# EAGLE design primobot (EAGLE 7.2.0)
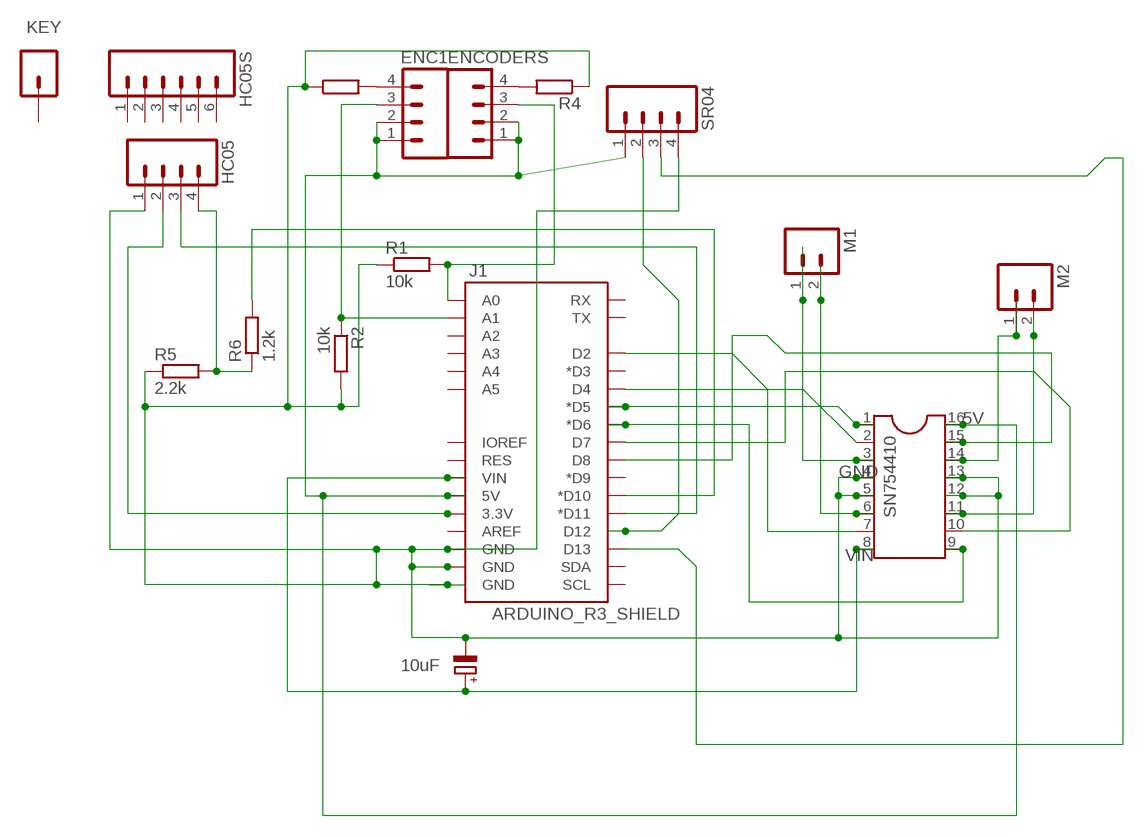
[diagram p0: schematic, sheet 1]

## Parts
C1  10uF  CPOL-EUE5-10.5  [E5-10,5]
ENC1  M04PTH  [1X04]
ENCODERS  M04PTH  [1X04]
HC05  M04PTH  [1X04]
HC05S  M06SILK_FEMALE_PTH  [1X06]
J1  ARDUINO_R3_SHIELD  [UNO_R3_SHIELD]
KEY  M01PTH  [1X01]
M1  M02PTH  [1X02]
M2  M02PTH  [1X02]
R1  10k  R-EU_0207/10  [0207/10]
R2  10k  R-EU_0207/10  [0207/10]
R3  R-EU_0207/10  [0207/10]
R4  R-EU_0207/10  [0207/10]
R5  2.2k  R-EU_0207/10  [0207/10]
R6  1.2k  R-EU_0207/10  [0207/10]
SN754410  DIL16S  [SOCKET-16]
SR04  M04PTH  [1X04]

## Nets
5V: ENC1.1 ENC1.2 ENCODERS.1 ENCODERS.2 J1.5V SN754410.16 SR04.1
GND: C1.- HC05.1 J1.GND@0(GND) J1.GND@1(GND) J1.GND@2(GND) R1.1 R2.2 R3.1 R4.1 R5.1 SN754410.4 SN754410.5 SN754410.12 SN754410.13 SR04.4
N$1: J1.D5(*D5) SN754410.1
N$2: M1.2 SN754410.6
N$3: M1.1 SN754410.3
N$4: J1.D13 SR04.3
N$5: M2.1 SN754410.14
N$6: M2.2 SN754410.11
N$7: J1.D7 SN754410.10
N$8: HC05.2 J1.3.3V
N$9: J1.D2 SN754410.7
N$10: J1.D8 SN754410.15
N$11: HC05.3 J1.D11(*D11)
N$12: J1.D6(*D6) SN754410.9
N$13: HC05.4 R5.2 R6.1
N$14: J1.D10(*D10) R6.2
N$15: ENCODERS.4 R4.2
N$16: ENC1.4 R3.2
N$17: ENCODERS.3 J1.A0 R1.2
N$18: ENC1.3 J1.A1 R2.1
N$19: J1.D4 SN754410.2
N$20: J1.D12 SR04.2
VIN: C1.+ J1.VIN SN754410.8
Unconnected: HC05S.1 HC05S.2 HC05S.3 HC05S.4 HC05S.5 HC05S.6 J1.A2 J1.A3 J1.A4 J1.A5 J1.AREF J1.D3(*D3) J1.D9(*D9) J1.IOREF J1.RES J1.RX J1.SCL J1.SDA J1.TX KEY.1

## Library data of the parts
C1 = rcl:CPOL-EU: POLARIZED CAPACITOR, European symbol
ENC1 ENCODERS HC05 SR04 = SparkFun-Connectors:M04: Header 4 Standard 4-pin 0.1" header. Use with straight break away headers (SKU : PRT-00116), right angle break away headers (PRT-00553), swiss pins (PRT-00743), machine pins (PRT-00117), and female headers (PRT-00115). Molex polarized connector foot print use with SKU : PRT-08231 with associated crimp pins and housings. 1MM SMD Version SKU: PRT-10208
HC05S = SparkFun-Connectors:M06: Header 6 Standard 6-pin 0.1" header. Use with straight break away headers (SKU : PRT-00116), right angle break away headers (PRT-00553), swiss pins (PRT-00743), machine pins (PRT-00117), and female headers (PRT-00115). Molex polarized connector foot print use with SKU : PRT-08094 with associated crimp pins and housings. NOTES ON THE VARIANTS LOCK and LOCK_LONGPADS... This footprint was designed to help hold the alignment of a through-hole component (i.e. 6-pin header) while soldering it into place. You may notice that each hole has been shifted either up or down by 0.005 of an inch from it's more standard position (which is a perfectly straight line). This slight alteration caused the pins (the squares in the middle) to touch the edges of the holes. Because they are alternating, it causes a "brace" to hold the component in place. 0.005 has proven to be the perfect amount of "off-center" position when using our standard breakaway headers. Although looks a little odd when you look at the bare footprint, once you have a header in there, the alteration is very hard to notice. Also,if you push a header all the way into place, it is covered up entirely on the bottom side. This idea of altering the position of holes to aid alignment will be further integrated into the Sparkfun Library for other footprints. It can help hold any component with 3 or more connection pins.; PROD_ID: CONN-08437
J1 = SparkFun-Boards:ARDUINO_R3_SHIELD: Shield form compatible with the Arduino Uno R3.
KEY = SparkFun-Connectors:M01: Header 1 Standard 1-pin 0.1" header. Use with straight break away headers (SKU : PRT-00116), right angle break away headers (PRT-00553), swiss pins (PRT-00743), machine pins (PRT-00117), and female headers (PRT-00115).
M1 M2 = SparkFun-Connectors:M02: Standard 2-pin 0.1" header. Use with - straight break away headers ( PRT-00116) - right angle break away headers (PRT-00553) - swiss pins (PRT-00743) - machine pins (PRT-00117) - female headers (PRT-00115) Molex polarized connector foot print use with: PRT-08233 with associated crimp pins and housings. 2.54_SCREWTERM for use with PRT-10571. 3.5mm Screw Terminal footprints for PRT-08084 5mm Screw Terminal footprints for use with PRT-08432
R1-R6 = rcl:R-EU_: RESISTOR, European symbol
SN754410 = ic-package:DIL16: Dual In Line / Socket

## Board
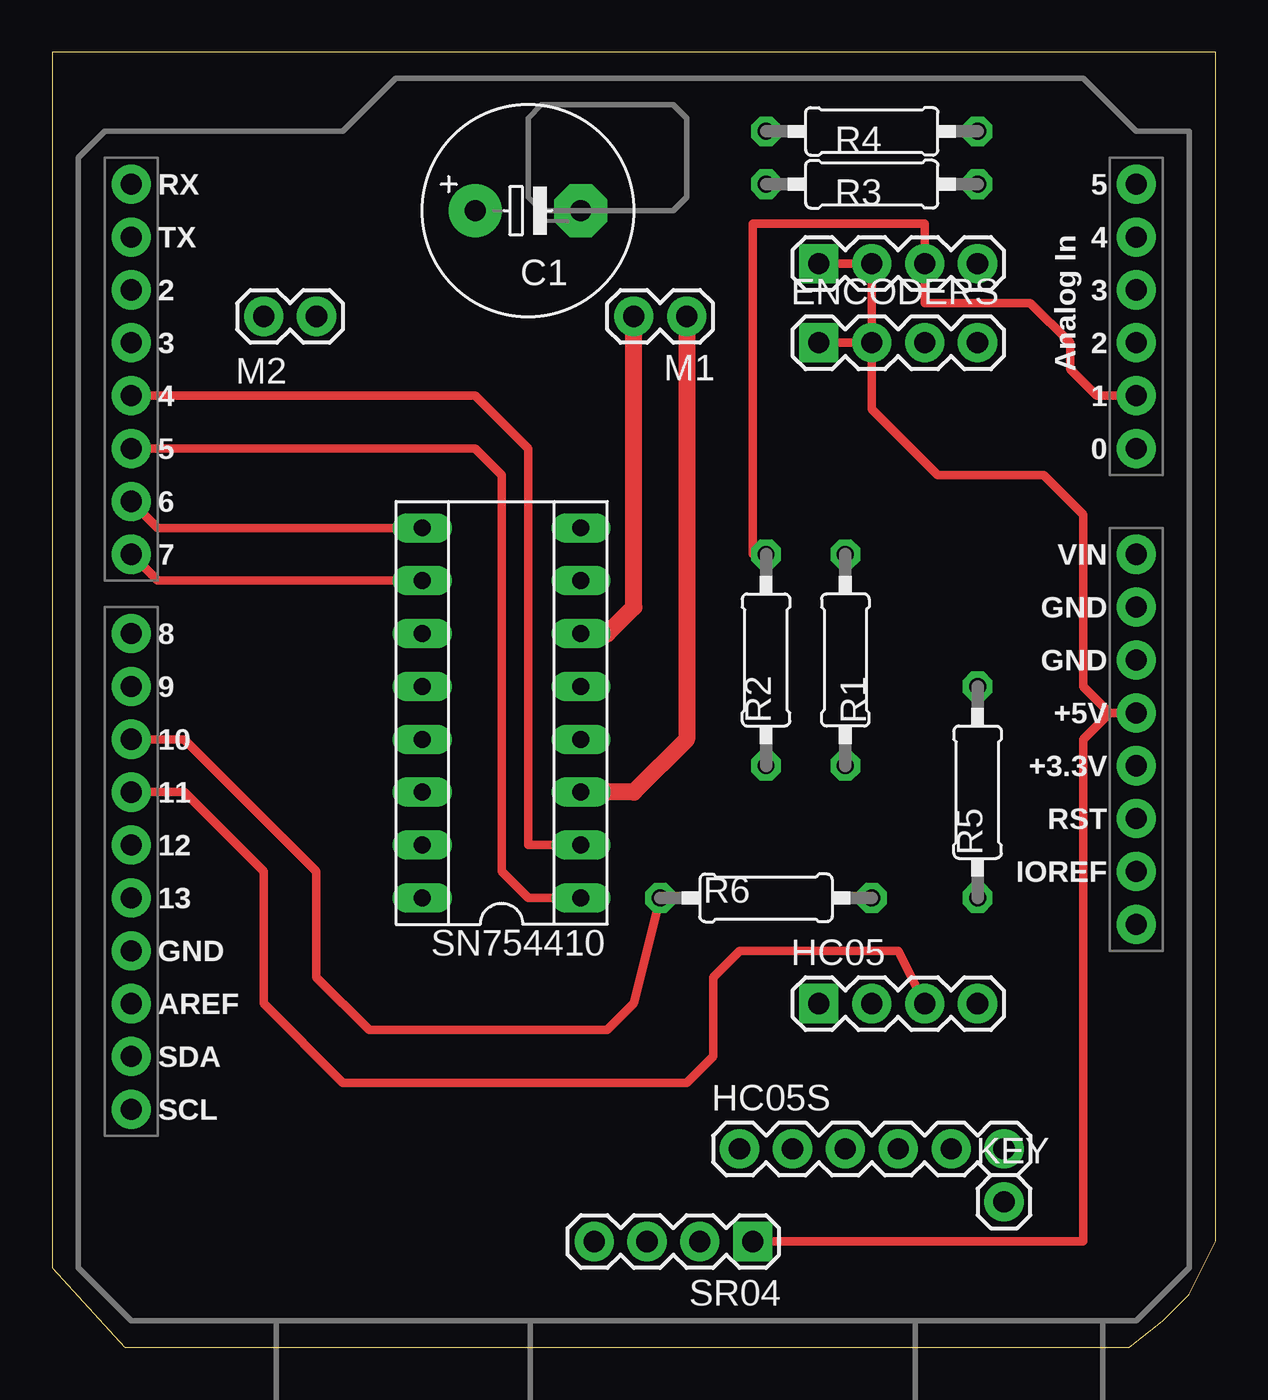
[diagram p1: board, top side]
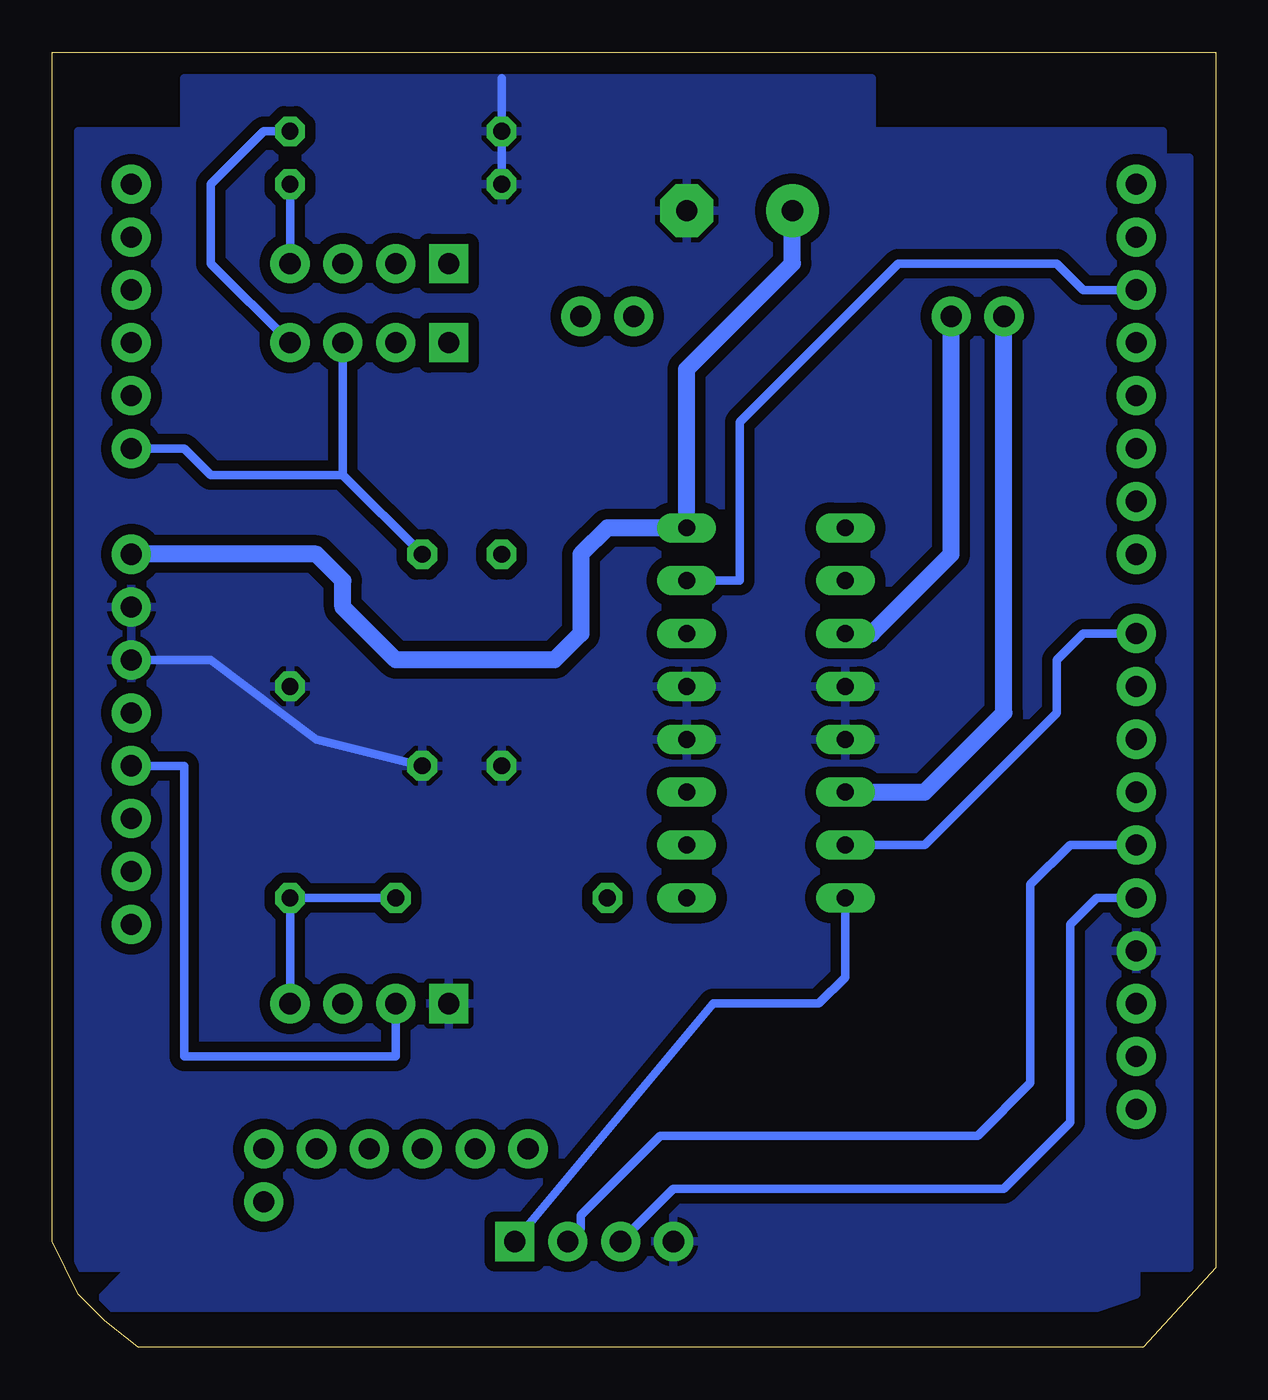
[diagram p2: board, bottom side, seen from below]

Size 55.88 x 62.24 mm. Coordinates in mm from the lower left corner, seen from the top.
Outline: 0,3.82 3.48,0.01 51.74,0 53.34,1.28 54.61,2.55 55.88,5.09 55.88,62.24 30.48,62.24 20.33,62.23 0,62.23 0,3.82
Copper layers (1*16): Top 0.035mm / dielectric 1.5mm / Bottom 0.035mm
Design rules "SeeedStudio_2layer_DRU_no_angle_20140221 *": minimum track width 8mil, minimum drill 20mil, track to track 8mil, track to pad 8mil, pad to pad 8mil, via to via 8mil, smd to smd 8mil, copper to edge 10mil, drill to drill 8mil, minimum pad ring 12mil, minimum via ring 10mil, stop-mask expansion 4mil, vias tented up to drill 25mil, thermal gap 10mil

### Footprints (pad centres in the part's own frame; a part is rotated, then mirrored left to right if it is on the bottom)
E5-10,5 = drill 1.016 pad 2.54: + -2.54,0 | drill 1.016 pad 2.54 octagon: - 2.54,0
1X04 = drill 1.016 pad 1.88 square: 1 0,0 | drill 1.016 pad 1.88: 2 2.54,0; 3 5.08,0; 4 7.62,0
1X06 = drill 1.016 pad 1.88: 1 0,0; 2 2.54,0; 3 5.08,0; 4 7.62,0; 5 10.16,0; 6 12.7,0
UNO_R3_SHIELD = drill 1.016 pad 1.88: 3.3V 50.8,26.67; 5V 50.8,29.21; A0 50.8,41.91; A1 50.8,44.45; A2 50.8,46.99; A3 50.8,49.53; A4 50.8,52.07; A5 50.8,54.61; AREF 2.54,15.24; D2 2.54,49.53; D3 2.54,46.99; D4 2.54,44.45; D5 2.54,41.91; D6 2.54,39.37; D7 2.54,36.83; D8 2.54,33.02; D9 2.54,30.48; D10 2.54,27.94; D11 2.54,25.4; D12 2.54,22.86; D13 2.54,20.32; GND@0 50.8,31.75; GND@1 50.8,34.29; GND@2 2.54,17.78; IOREF 50.8,21.59; NC 50.8,19.05; RES 50.8,24.13; RX 2.54,54.61; SCL 2.54,10.16; SDA 2.54,12.7; TX 2.54,52.07; VIN 50.8,36.83
1X01 = drill 1.016 pad 1.88: 1 0,0
1X02 = drill 1.016 pad 1.88: 1 0,0; 2 2.54,0
0207/10 = drill 0.813 octagon: 1 -5.08,0; 2 5.08,0
SOCKET-16 = drill 0.813 long: 1 -8.89,-3.81; 2 -6.35,-3.81; 3 -3.81,-3.81; 4 -1.27,-3.81; 5 1.27,-3.81; 6 3.81,-3.81; 7 6.35,-3.81; 8 8.89,-3.81; 9 8.89,3.81; 10 6.35,3.81; 11 3.81,3.81; 12 1.27,3.81; 13 -1.27,3.81; 14 -3.81,3.81; 15 -6.35,3.81; 16 -8.89,3.81

### Placement (x,y rotation side)
C1  22.86,54.62 0 top
ENC1  36.83,52.08 0 top
ENCODERS  36.83,48.27 0 top
HC05  36.83,16.52 0 top
HC05S  33.02,9.54 0 top
J1  1.27,1.28 0 top
KEY  45.72,7 0 top
M1  30.48,49.54 180 top
M2  10.16,49.54 0 top
R1  38.1,33.03 90 top
R2  34.29,33.03 270 top
R3  39.37,55.89 0 top
R4  39.37,58.43 0 top
R5  44.45,26.68 270 top
R6  34.29,21.6 180 top
SN754410  21.59,30.49 90 top
SR04  33.66,5.09 180 top

### Tracks (layer width: path | path; a pad name or v marks a point on that pad's centre or on a via)
5V
  Top 0.406: SR04.1 49.53,5.09 49.53,29.22 50.8,30.49 | 50.8,30.49 J1.5V | ENC1.1 ENC1.2 ENCODERS.2 | ENCODERS.1 ENCODERS.2 | 50.8,30.49 49.53,31.76 49.53,40.02 47.62,41.92 42.55,41.92 39.37,45.09 ENCODERS.2
  Bottom 0.406: SR04.1 24.13,16.52 19.05,16.52 17.78,17.79 SN754410.16
GND
  Bottom 0.406: J1.GND@0 48.26,33.03 43.18,29.22 R1.1 | 34.29,60.97 R3.1
  pour Bottom (isolate 0.508): 1.27,57.16 1.27,3.82 3.81,3.82 3.81,2.55 5.71,1.91 53.98,1.91 52.07,3.82 54.61,3.82 54.61,58.43 49.53,58.43 49.53,60.97 16.51,60.97 16.51,58.43 2.54,58.43 2.54,57.16
N$1
  Top 0.406: SN754410.1 22.86,21.6 21.59,22.87 21.59,41.92 20.32,43.19 J1.D5
N$2
  Top 0.813: SN754410.6 26.67,34.3 27.94,35.57 M1.2
N$3
  Top 0.813: M1.1 30.48,29.22 27.94,26.68 SN754410.3
N$4
  Bottom 0.406: 3.17,21.6 J1.D13 5.71,21.6 6.99,20.33 6.99,10.8 10.16,7.63 26.04,7.63 SR04.3
N$5
  Bottom 0.813: SN754410.14 13.97,26.68 10.16,30.49 M2.1
N$6
  Bottom 0.813: SN754410.11 16.51,34.3 12.7,38.11 M2.2
N$7
  Top 0.406: J1.D7 5.08,36.84 SN754410.10
N$8
  Bottom 0.406: J1.3.3V 49.53,27.95 49.53,13.98 39.37,13.98 HC05.2
N$9
  Bottom 0.406: SN754410.7 22.86,36.84 22.86,44.46 15.24,52.08 7.62,52.08 6.35,50.81 J1.D2
N$10
  Bottom 0.406: SN754410.15 13.97,24.14 7.62,30.49 7.62,33.03 6.35,34.3 J1.D8
N$11
  Top 0.406: HC05.3 40.64,19.06 33.02,19.06 31.75,17.79 31.75,13.98 30.48,12.71 13.97,12.71 10.16,16.52 10.16,22.87 6.35,26.68 J1.D11
N$12
  Top 0.406: SN754410.9 5.08,39.38 J1.D6
N$13
  Bottom 0.406: HC05.4 R5.2 R6.1
N$14
  Top 0.406: R6.2 27.94,16.52 26.67,15.25 15.24,15.25 12.7,17.79 12.7,22.87 6.35,29.22 J1.D10
N$15
  Bottom 0.406: ENCODERS.4 48.26,52.08 48.26,55.89 45.72,58.43 R4.2
N$16
  Bottom 0.406: ENC1.4 R3.2
N$17
  Bottom 0.406: ENCODERS.3 41.91,41.92 | J1.A0 49.53,43.19 48.26,41.92 41.91,41.92 | R1.2 41.91,41.92
N$18
  Top 0.406: J1.A1 50.16,45.73 48.9,47 48.9,48.27 46.99,50.17 41.91,50.17 ENC1.3 41.91,53.98 33.66,53.98 33.66,38.11 R2.1
N$19
  Top 0.406: SN754410.2 22.86,24.14 22.86,43.19 20.32,45.73 J1.D4
N$20
  Bottom 0.406: SR04.2 30.48,5.73 30.48,6.36 26.67,10.17 11.43,10.17 8.89,12.71 8.89,22.24 6.99,24.14 J1.D12
VIN
  Bottom 0.813: C1.+ 20.32,52.08 25.4,47 SN754410.8 29.21,39.38 30.48,38.11 30.48,34.3 31.75,33.03 39.37,33.03 41.91,35.57 41.91,36.84 43.18,38.11 J1.VIN